# Altium schematic sheet Power Supply.SchDoc: Power Supply
size A4; SheetNumber: 8; SheetTotal: 10; Project: WSN Z1; Comments: Power Supply
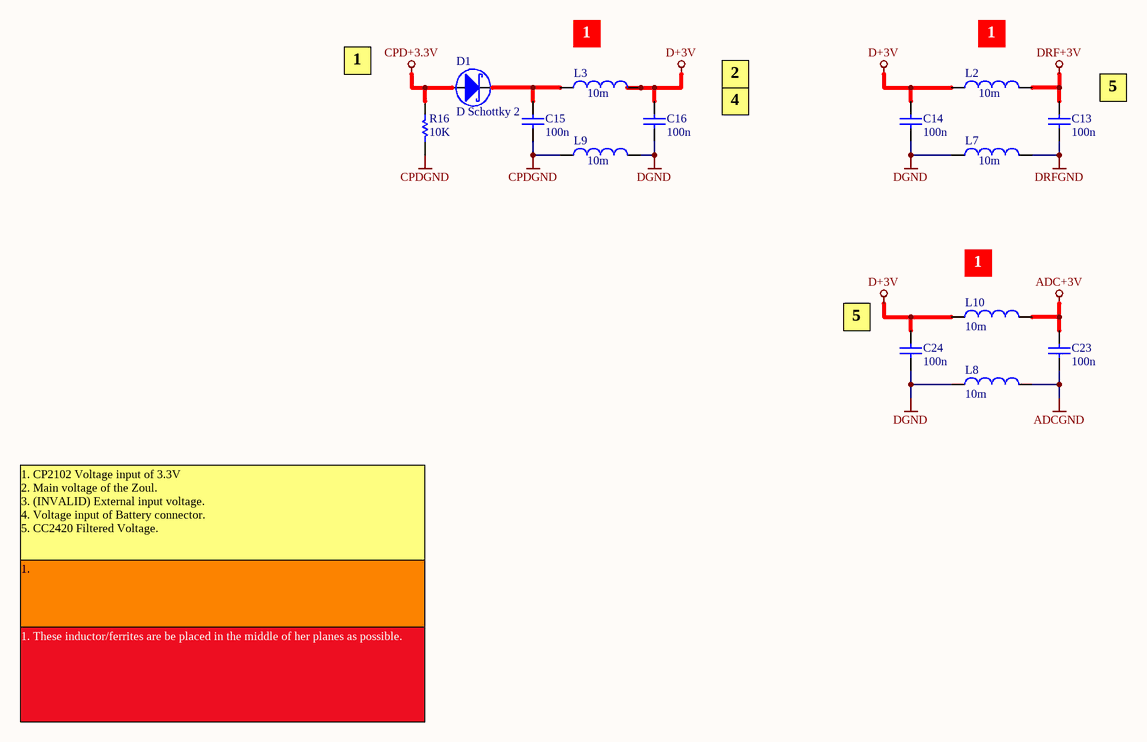
[diagram p0: Power Supply.SchDoc]

## Parts
C13  value 100n  [CC-0402-AL]  (hidden comment: Cap Semi)
C14  value 100n  [CC-0402-AL]  (hidden comment: Cap Semi)
C15  value 100n  [CC-0402-AL]  (hidden comment: Cap Semi)
C16  value 100n  [CC-0402-AL]  (hidden comment: Cap Semi)
C23  value 100n  [CC-0402-AL]  (hidden comment: Cap Semi)
C24  value 100n  [CC-0402-AL]  (hidden comment: Cap Semi)
D1  D Schottky 2  [STPS140A]
L2  value 10m  [CR-0402-AL]  (hidden comment: Inductor)
L3  value 10m  [CR-0402-AL]  (hidden comment: Inductor)
L7  value 10m  [CR-0402-AL]  (hidden comment: Inductor)
L8  value 10m  [CR-0402-AL]  (hidden comment: Inductor)
L9  value 10m  [CR-0402-AL]  (hidden comment: Inductor)
L10  value 10m  [CR-0402-AL]  (hidden comment: Inductor)
R16  value 10K  [CR-0402-AL]  (hidden comment: Res Semi)

## Nets
ADC+3V: C23.2 L10.1
ADCGND: C23.1 L8.1
CPD+3.3V: D1.1(A) R16.1
CPDGND: C15.2 L9.1 R16.2
D+3V: C14.2 C16.1 C24.1 L2.1 L3.2 L10.2
DGND: C14.1 C16.2 C24.2 L7.1 L8.2 L9.2
DRF+3V: C13.1 L2.2
DRFGND: C13.2 L7.2
NetC15_1: C15.1 D1.2(K) L3.1

## Notes on the sheet
- (near L3) 1
- (near L2) 1
- 1
- 4
- 2
- (near C13) 5
- (near L10) 1
- (near C24) 5
- 1. CP2102 Voltage input of 3.3V
  2. Main voltage of the Zoul.
  3. (INVALID) External input voltage.
  4. Voltage input of Battery connector.
  5. CC2420 Filtered Voltage.
- 1.
- 1. These inductor/ferrites are be placed in the middle of her planes as possible.

## Library data of the parts
C13-C16 C23 C24 = Cap Semi: Capacitor (Semiconductor SIM Model)
D1 = D Schottky 2: Schotkky Diode 1N5820
R16 = Res Semi: Semiconductor Resistor; Manufacturer: Generic Components